# EAGLE design uc4h node v2010 (EAGLE 7.5.0)
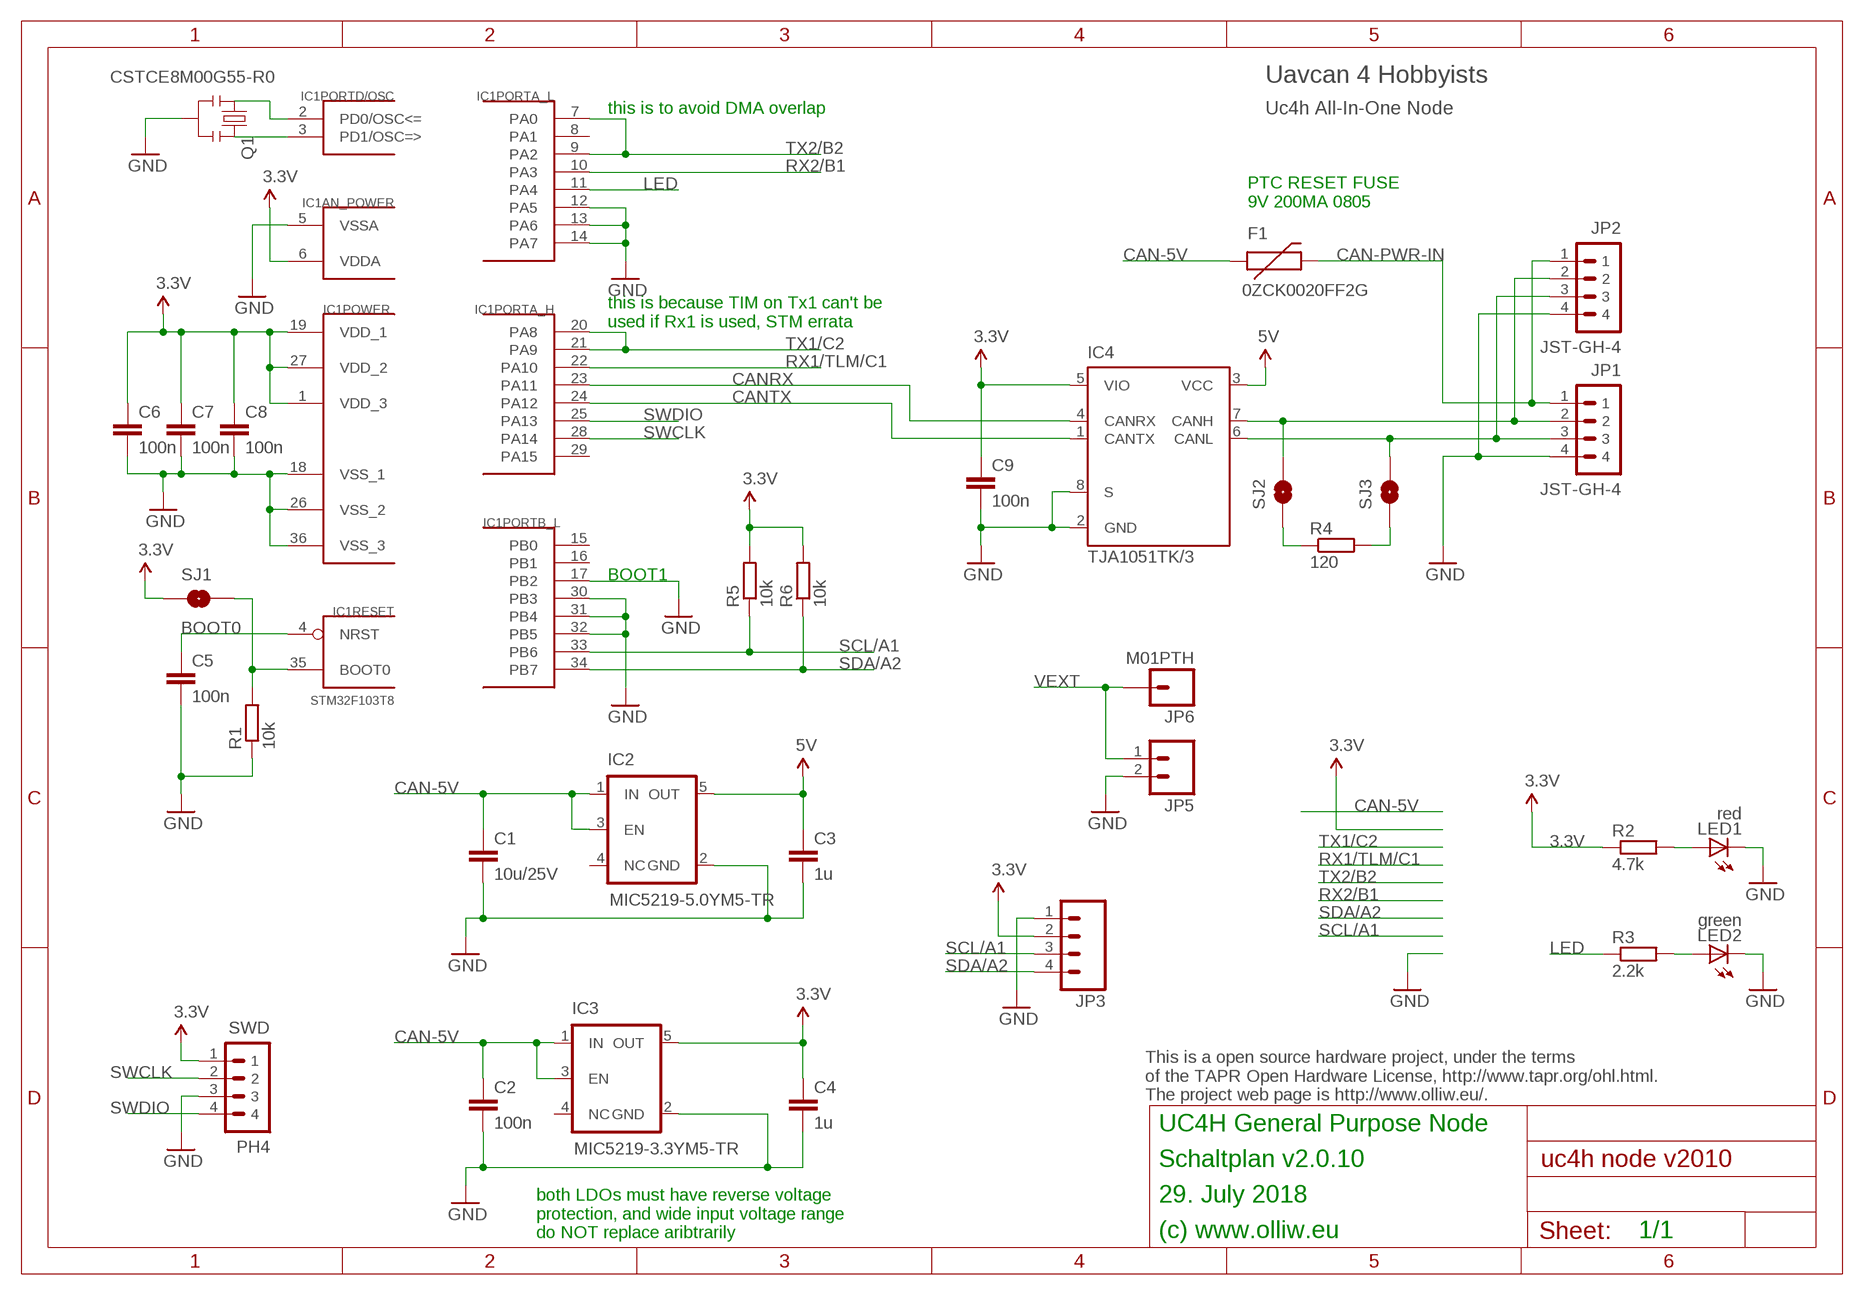
[diagram p0: schematic, sheet 1]

## Parts
C1  10u/25V  C-EUC1206  [C1206]
C2  100n  C-EUC0603K  [C0603K]
C3  1u  C-EUC0603K  [C0603K]
C4  1u  C-EUC0603K  [C0603K]
C5  100n  C-EUC0603K  [C0603K]
C6  100n  C-EUC0603K  [C0603K]
C7  100n  C-EUC0603K  [C0603K]
C8  100n  C-EUC0603K  [C0603K]
C9  100n  C-EUC0603K  [C0603K]
F1  0ZCK0020FF2G  FUSE-PTCFUSE-0805  [FUSE-0805]
IC1  STM32F103T8  STM32F10XTXU6  [VFQFPN36]
IC2  MIC5219-5.0YM5-TR  V_REG_TPS76433SOT23-5  [SOT23-5]
IC3  MIC5219-3.3YM5-TR  V_REG_TPS76433SOT23-5  [SOT23-5]
IC4  TJA1051TK/3  [HVSON8]
JP1  JST-GH-4  [SM04B-GHS-TB]
JP2  JST-GH-4  [SM04B-GHS-TB]
JP3  M04PTH  [1X04]
JP5  M02PTH  [1X02]
JP6  M01PTH  [1X01]
LED1  red  LEDCHIPLED_0603  [CHIPLED_0603]
LED2  green  LEDCHIPLED_0603  [CHIPLED_0603]
Q1  CSTCE8M00G55-R0  RESONATORSMD  [RESONATOR-SMD]
R1  10k  R-EU_R0603  [R0603]
R2  4.7k  R-EU_R0603  [R0603]
R3  2.2k  R-EU_R0603  [R0603]
R4  120  R-EU_R0603  [R0603]
R5  10k  R-EU_R0603  [R0603]
R6  10k  R-EU_R0603  [R0603]
SJ1  BOOT0  SOLDERJUMPERNO  [SJ_2S-NO]
SJ2  SOLDERJUMPERNO  [SJ_2S-NO]
SJ3  SOLDERJUMPERNO  [SJ_2S-NO]
SWD  PH4  P4X1_1P27-OCT_BILEX  [4X1_1P27_OCT_BILEX]

## Nets
3.3V: C4.1 C6.1 C7.1 C8.1 C9.1 IC1.1(POWER:VDD_3) IC1.6(AN_POWER:VDDA) IC1.19(POWER:VDD_1) IC1.27(POWER:VDD_2) IC3.5(OUT) IC4.5(VIO) JP3.2 R2.1 R5.2 R6.2 SJ1.1 SWD.1
5V: C3.1 IC2.5(OUT) IC4.3(VCC)
CAN-5V: C1.1 C2.1 F1.1 IC2.1(IN) IC2.3(EN) IC3.1(IN) IC3.3(EN)
CAN-PWR-IN: F1.2 JP1.1 JP2.1
CANH: IC4.7(CANH) JP1.2 JP2.2 SJ2.2
CANL: IC4.6(CANL) JP1.3 JP2.3 SJ3.2
CANRX: IC1.23(PORTA_H:PA11) IC4.4(CANRX)
CANTX: IC1.24(PORTA_H:PA12) IC4.1(CANTX)
GND: C1.2 C2.2 C3.2 C4.2 C5.2 C6.2 C7.2 C8.2 C9.2 IC1.5(AN_POWER:VSSA) IC1.12(PORTA_L:PA5) IC1.13(PORTA_L:PA6) IC1.14(PORTA_L:PA7) IC1.17(PORTB_L:PB2) IC1.18(POWER:VSS_1) IC1.26(POWER:VSS_2) IC1.30(PORTB_L:PB3) IC1.31(PORTB_L:PB4) IC1.32(PORTB_L:PB5) IC1.36(POWER:VSS_3) IC2.2(GND) IC3.2(GND) IC4.2(GND) IC4.8(S) JP1.4 JP2.4 JP3.1 JP5.2 LED1.C LED2.C Q1.2 R1.1 SWD.3
LED: IC1.11(PORTA_L:PA4) R3.1
N$1: C5.1 IC1.4(RESET:NRST)
N$2: LED2.A R3.2
N$4: R4.1 SJ2.1
N$5: IC1.2(PORTD/OSC:PD0/OSC<=) Q1.1
N$6: IC1.3(PORTD/OSC:PD1/OSC=>) Q1.3
N$7: R4.2 SJ3.1
N$8: IC1.35(RESET:BOOT0) R1.2 SJ1.2
N$9: LED1.A R2.2
RX1/TLM/C1: IC1.22(PORTA_H:PA10)
RX2/B1: IC1.10(PORTA_L:PA3)
SCL/A1: IC1.33(PORTB_L:PB6) JP3.3 R5.1
SDA/A2: IC1.34(PORTB_L:PB7) JP3.4 R6.1
SWCLK: IC1.28(PORTA_H:PA14) SWD.2
SWDIO: IC1.25(PORTA_H:PA13) SWD.4
TX1/C2: IC1.20(PORTA_H:PA8) IC1.21(PORTA_H:PA9)
TX2/B2: IC1.7(PORTA_L:PA0) IC1.9(PORTA_L:PA2)
VEXT: JP5.1 JP6.1
Unconnected: IC1.8(PORTA_L:PA1) IC1.15(PORTB_L:PB0) IC1.16(PORTB_L:PB1) IC1.29(PORTA_H:PA15) IC2.4(NC) IC3.4(NC)

## Notes on the sheet
- Uavcan 4 Hobbyists
- Uc4h All-In-One Node
- this is to avoid DMA overlap
- PTC RESET FUSE
  9V 200MA 0805
- this is because TIM on Tx1 can't be
  used if Rx1 is used, STM errata
- BOOT1
- This is a open source hardware project, under the terms
  of the TAPR Open Hardware License, http://www.tapr.org/ohl.html.
  The project web page is http://www.olliw.eu/.
- UC4H General Purpose Node
- Schaltplan v2.0.10
- 29. July 2018
- both LDOs must have reverse voltage
  protection, and wide input voltage range
  do NOT replace aribtrarily
- (c) www.olliw.eu | 1/1

## Library data of the parts
C1-C9 = rcl:C-EU: CAPACITOR, European symbol
F1 = # stdlib:FUSE-PTC
IC1 = # stm32:STM32F10XTXU6: STM32F101/103 36pad VFQPFN36
IC2 IC3 = # SparkFun2:V_REG_TPS76433: Voltage Regulator Older TI part. LDO 150mA regulator. No output by-pass cap option. See V_REG_LDO for a better part.
IC4 = # stdlib:TJA1051TK/3
JP1 JP2 = # stdlib:JST-GH-4
JP3 = # SparkFun2:M04: Header 4 Standard 4-pin 0.1" header. Use with straight break away headers (SKU : PRT-00116), right angle break away headers (PRT-00553), swiss pins (PRT-00743), machine pins (PRT-00117), and female headers (PRT-00115). Molex polarized connector foot print use with SKU : PRT-08231 with associated crimp pins and housings. 1MM SMD Version SKU: PRT-10208
JP5 = # SparkFun2:M02: Header 2 Standard 2-pin 0.1" header. Use with straight break away headers (SKU : PRT-00116), right angle break away headers (PRT-00553), swiss pins (PRT-00743), machine pins (PRT-00117), and female headers (PRT-00115). Molex polarized connector foot print use with SKU : PRT-08233 with associated crimp pins and housings.
JP6 = # SparkFun2:M01: Header 1 Standard 1-pin 0.1" header. Use with straight break away headers (SKU : PRT-00116), right angle break away headers (PRT-00553), swiss pins (PRT-00743), machine pins (PRT-00117), and female headers (PRT-00115).
LED1 LED2 = led:LED: LED OSRAM: - CHIPLED LG R971, LG N971, LY N971, LG Q971, LY Q971, LO R971, LY R971 LH N974, LH R974 LS Q976, LO Q976, LY Q976 LO Q996 - Hyper CHIPLED LW Q18S LB Q993, LB Q99A, LB R99A - SideLED LS A670, LO A670, LY A670, LG A670, LP A670 LB A673, LV A673, LT A673, LW A673 LH A674 LY A675 LS A676, LA A676, LO A676, LY A676, LW A676 LS A679, LY A679, LG A679 - Hyper Micro SIDELED® LS Y876, LA Y876, LO Y876, LY Y876 LT Y87S - SmartLED LW L88C, LW L88S LB L89C, LB L89S, LG L890 LS L89K, LO L89K, LY L89K LS L896, LA L896, LO L896, LY L896 - TOPLED LS T670, LO T670, LY T670, LG T670, LP T670 LSG T670, LSP T670, LSY T670, LOP T670, LYG T670 LG T671, LOG T671, LSG T671 LB T673, LV T673, LT T673, LW T673 LH T674 LS T676, LA T676, LO T676, LY T676, LB T676, LH T676, LSB T676, LW T676 LB T67C, LV T67C, LT T67C, LS T67K, LO T67K, LY T67K, LW E67C LS E67B, LA E67B, LO E67B, LY E67B, LB E67C, LV E67C, LT E67C LW T67C LS T679, LY T679, LG T679 LS T770, LO T770, LY T770, LG T770, LP T770 LB T773, LV T773, LT T773, LW T773 LH T774 LS E675, LA E675, LY E675, LS T675 LS T776, LA T776, LO T776, LY T776, LB T776 LHGB T686 LT T68C, LB T68C - Hyper Mini TOPLED® LB M676 - Mini TOPLED Santana® LG M470 LS M47K, LO M47K, LY M47K Source: http://www.osram.convergy.de LUXEON: - LUMILED® LXK2-PW12-R00, LXK2-PW12-S00, LXK2-PW14-U00, LXK2-PW14-V00 LXK2-PM12-R00, LXK2-PM12-S00, LXK2-PM14-U00 LXK2-PE12-Q00, LXK2-PE12-R00, LXK2-PE12-S00, LXK2-PE14-T00, LXK2-PE14-U00 LXK2-PB12-K00, LXK2-PB12-L00, LXK2-PB12-M00, LXK2-PB14-N00, LXK2-PB14-P00, LXK2-PB14-Q00 LXK2-PR12-L00, LXK2-PR12-M00, LXK2-PR14-Q00, LXK2-PR14-R00 LXK2-PD12-Q00, LXK2-PD12-R00, LXK2-PD12-S00 LXK2-PH12-R00, LXK2-PH12-S00 LXK2-PL12-P00, LXK2-PL12-Q00, LXK2-PL12-R00 Source: www.luxeon.com KINGBRIGHT: KA-3528ASYC Source: www.kingbright.com
Q1 = # SparkFun2:RESONATOR: Resonator Small SMD resonator. This is the itty bitty 10/20MHz resonators with built in caps. CSTCE10M0G55 and CSTCE20M0V53. Footprint has been reviewed closely but hasn't been tested yet.
R1-R6 = rcl:R-EU_: RESISTOR, European symbol
SJ1-SJ3 = # SparkFun2:SOLDERJUMPER: Solder Jumper Standard SMD solder jumper. Used to automate production. Two varients : Normally Open and Normally Closed are the same, but have different paste layers. NC will have a large amount of paste and should jumper during reflow.
SWD = # stdlib:P4X1_1P27

## Board
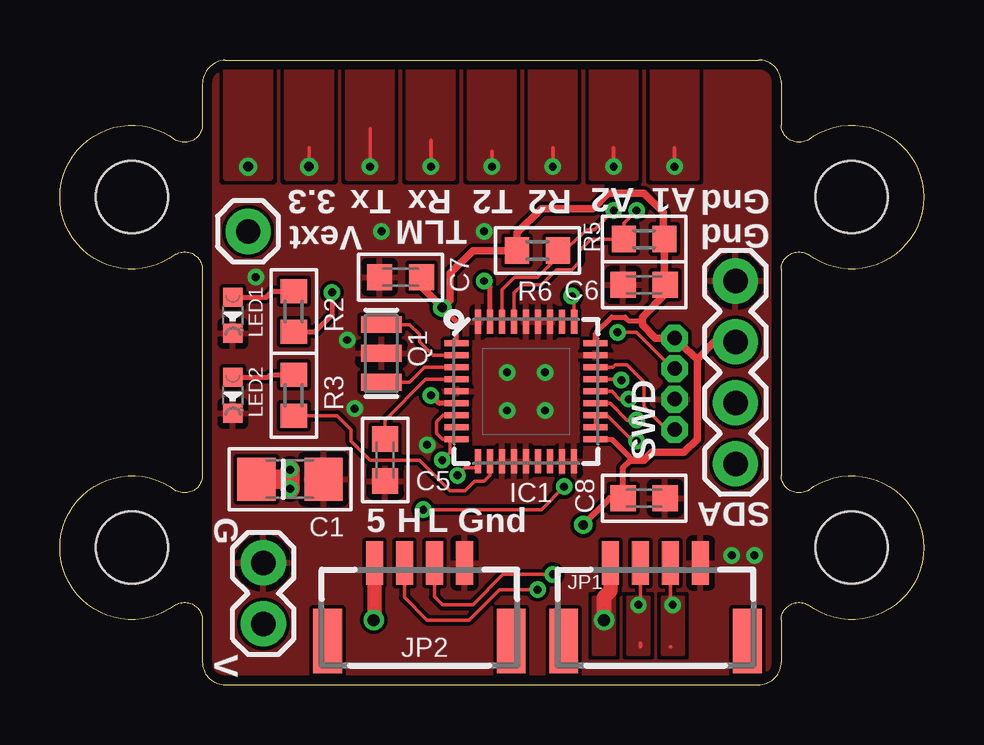
[diagram p1: board, top side]
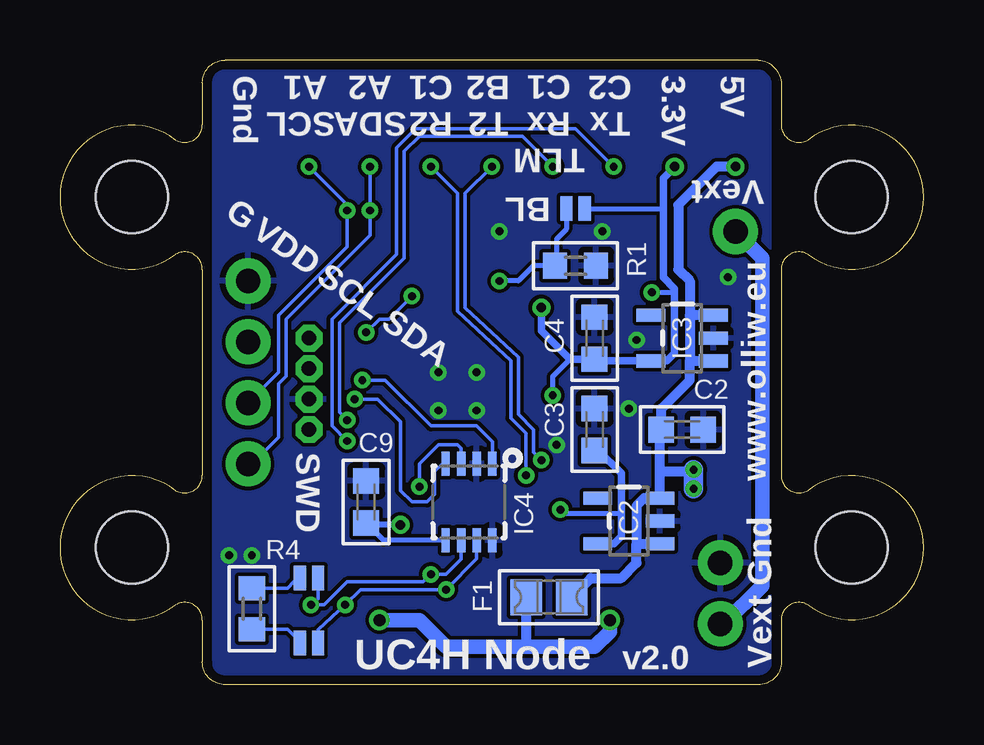
[diagram p2: board, bottom side, seen from below]

Size 36 x 26.04 mm. Coordinates in mm from the lower left corner, seen from the top.
Outline: 6.89,0 29.11,0 arc90 30.07,0.95 30.07,2.7 arc-120 31.18,3.33 arc255 31.18,8.1 arc-120 30.07,8.73 30.07,17.3 arc-120 31.18,17.94 arc255 31.18,22.7 arc-120 30.07,23.34 30.07,25.08 arc90 29.11,26.04 6.89,26.04 arc90 5.94,24.92 5.94,23.34 arc-120 4.83,22.7 arc255 4.83,17.94 arc-120 5.94,17.3 5.94,8.73 arc-120 4.83,8.1 arc255 4.83,3.33 arc-120 5.94,2.7 5.94,0.95 arc90 6.89,0
Copper layers (1*16): Top 0.0356mm / dielectric 1.5011mm / Bottom 0.0356mm
Design rules "ow-oshpark-2layer": minimum track width 6mil, minimum drill 13mil, track to track 6mil, track to pad 6mil, pad to pad 6mil, via to via 6mil, smd to smd 6mil, copper to edge 15mil, drill to drill 6mil, minimum pad ring 7mil, minimum via ring 7mil, stop-mask expansion 2.5mil, vias tented up to drill 26mil, thermal gap 10mil
Holes 3 mm at 3,20.32 33,20.32 3,5.71 33,5.71

### Footprints (pad centres in the part's own frame; a part is rotated, then mirrored left to right if it is on the bottom)
C1206 = smd 1.6 x 1.8: 1 -1.4,0; 2 1.4,0
C0603K = smd 1.05 x 1.08: 1 -0.875,0; 2 0.875,0
FUSE-0805 = smd 1.3 x 1.5: 1 -0.95,0; 2 0.95,0
VFQFPN36 = smd 1 x 0.25: 1 -2.9,2; 2 -2.9,1.5; 3 -2.9,1; 4 -2.9,0.5; 5 -2.9,0; 6 -2.9,-0.5; 7 -2.9,-1; 8 -2.9,-1.5; 9 -2.9,-2; 19 2.9,-2; 20 2.9,-1.5; 21 2.9,-1; 22 2.9,-0.5; 23 2.9,0; 24 2.9,0.5; 25 2.9,1; 26 2.9,1.5; 27 2.9,2 | smd 0.25 x 1: 10 -2,-2.9; 11 -1.5,-2.9; 12 -1,-2.9; 13 -0.5,-2.9; 14 0,-2.9; 15 0.5,-2.9; 16 1,-2.9; 17 1.5,-2.9; 18 2,-2.9; 29 1.5,2.9; 30 1,2.9; 31 0.5,2.9; 32 0,2.9; 33 -0.5,2.9; 34 -1,2.9; 35 -1.5,2.9; 36 -2,2.9 | smd 0.27 x 1: 28 2,2.9
SOT23-5 = smd 0.55 x 1.2: 1 -0.95,-1.3; 2 0,-1.3; 3 0.95,-1.3; 4 0.95,1.3; 5 -0.95,1.3
HVSON8 = smd 1 x 0.35: 1 -1.6,0.975; 2 -1.6,0.325; 3 -1.6,-0.325; 4 -1.6,-0.975; 5 1.6,-0.975; 6 1.6,-0.325; 7 1.6,0.325; 8 1.6,0.975
SM04B-GHS-TB = smd 0.7 x 1.8: 1 -1.875,4.6; 2 -0.625,4.6; 3 0.625,4.6; 4 1.875,4.6 | smd 1.2 x 2.7: FIT@1 -3.825,1.35; FIT@2 3.825,1.35
1X04 = drill 1.016 pad 1.88: 1 0,0; 2 2.54,0; 3 5.08,0; 4 7.62,0
1X02 = drill 1.016 pad 1.88: 1 0,0; 2 2.54,0
1X01 = drill 1.016 pad 1.88: 1 0,0
CHIPLED_0603 = smd 0.8 x 0.8: A 0,-0.75; C 0,0.75
RESONATOR-SMD = smd 0.7 x 1.7: 1 -1.2,0; 2 0,0; 3 1.2,0
R0603 = smd 1 x 1.1: 1 -0.85,0; 2 0.85,0
SJ_2S-NO = smd 0.508 x 1.016: 1 -0.381,0; 2 0.381,0
4X1_1P27_OCT_BILEX = drill 0.61 pad 1.118 octagon: 1 0,0; 2 0,-1.27; 3 0,-2.54; 4 0,-3.81

### Placement (x,y rotation side)
C1  9.59,8.57 0 top
C2  10.06,10.64 0 bottom
C3  13.72,10.64 90 bottom
C4  13.72,14.45 90 bottom
C5  13.56,9.37 270 top
C6  24.35,16.67 180 top
C7  14.19,16.99 180 top
C8  24.35,7.78 0 top
C9  23.24,7.62 90 bottom
F1  15.62,3.65 180 bottom
IC1  19.43,12.22 0 top
IC2  12.29,6.83 90 bottom
IC3  10.06,14.45 90 bottom
IC4  18.95,7.62 270 bottom
JP1  24.83,0.48 0 top
JP2  14.99,0.48 0 top
JP3  28.16,16.83 270 top
JP5  8.48,2.54 90 top
JP6  7.84,18.89 0 top
LED1  7.21,15.4 180 top
LED2  7.21,12.06 180 top
Q1  13.4,13.81 270 top
R1  14.51,17.46 180 bottom
R2  9.75,15.56 90 top
R3  9.75,12.06 90 top
R4  28,3.17 90 bottom
R5  24.35,18.57 0 top
R6  19.91,18.1 180 top
SJ1  14.51,19.84 180 bottom
SJ2  25.62,1.75 0 bottom
SJ3  25.62,4.45 0 bottom
SWD  25.62,14.45 0 top

### Tracks (layer width: path | path; a pad name or v marks a point on that pad's centre or on a via)
3.3V  (via drill 0.33, 0.4)
  Top 0.152: 25.15,18.79 R5.2 | 25.2,17.01 C6.1 | C7.1 15.07,16.59 | v10.38,21.59 10.38,22.38
  Top 0.203: IC1.6 15.8,11.72 v15.46,12.06 | v11.34,16.35 11.34,15.4 10.64,14.71 R2.1 | IC1.27 22.33,14.65 23,15.32 23.56,15.32 23.72,15.16 24.27,15.16 | IC1.1 16.53,15.12 v15.94,15.72 | IC1.19 23.02,10.22 23.88,9.37
  Top 0.254: 23.8,9.37 23.48,9.05 C8.1 22.92,7.78 v21.81,6.67
  Top 0.305: 23.8,9.37 23.88,9.37 24.35,9.37 24.67,9.68 26.02,9.68 26.58,10.24 26.58,13.57 | 26.58,13.57 SWD.1 24.83,14.45 24.27,15 24.27,15.16 24.27,15.32 25.23,16.27 C6.1 | 25.15,18.79 25.15,19.68 24.35,20.48 22.84,20.48 22.21,19.84 20.07,19.84 19.06,18.84 R6.2 17.21,18.1 16.26,17.14 16.26,16.03 v15.94,15.72 15.07,16.59 | R5.2 25.2,17.01 | JP3.2 27.29,14.29 26.58,13.57
  Bottom 0.152: 11.68,13.49 IC3.5
  Bottom 0.203: IC4.5 22.52,6.02 C9.1 | 13.8,13.5 C4.1 | v15.46,12.06 15.46,12.86 14.75,13.57 | SJ1.1 10.86,19.84 | v11.34,16.35 10.38,16.35 10.38,16.11
  Bottom 0.254: v21.81,6.67 22.92,6.67 23,6.75 C9.1
  Bottom 0.305: IC3.5 13.8,13.5 | C4.1 14.75,13.57 15.94,14.76 v15.94,15.72 | v10.38,21.59 10.86,21.11 10.86,19.84 10.86,16.99 10.38,16.51 10.38,16.11 10.38,13.81 10.7,13.49 11.68,13.49
  pour Top (isolate 0.254, no thermals): 9.43,25.72 9.43,21.11 11.33,21.11 11.33,25.72
5V  (via drill 0.33)
  Top 0.152: v21.02,8.26 20.07,7.3 v15.15,7.3
  Bottom 0.152: IC4.3 19.28,9.85 19.43,10 20.22,10 21.02,9.21 v21.02,8.26 | C3.1 13.55,9.76
  Bottom 0.203: 13.56,6.07 IC2.5 | v15.15,7.3 14.99,7.14 12.6,7.14
  Bottom 0.305: IC2.5 12.92,5.88 12.6,6.19 12.6,7.14 12.6,8.81 13.55,9.76
CAN-5V  (via drill 0.33, 0.4)
  Top 0.152: 8.32,8.28 C1.1
  Top 0.203: 9.43,8.57 v9.59,8.97
  Top 0.813: C1.1 9.43,8.57 | v9.59,8.97 v9.59,8.18
  Bottom 0.152: 9.51,8.89 v9.59,8.97 | 9.11,15.27 IC3.3 | 9.75,15.4 9.75,15.24
  Bottom 0.203: IC2.1 | F1.1 | 10.99,10.27 C2.1 | 9.08,13.49 IC3.1
  Bottom 0.406: 11.97,5.87 11.97,7.46 11.66,7.78 IC2.3 10.99,8.89 | 11.97,5.87 IC2.1 | F1.1 13.87,4.45 12.6,4.45 11.97,5.08 11.97,5.87 | 10.99,8.89 10.99,10.27 | IC3.3 9.75,15.4 | 9.75,13.49 9.08,13.49 | C2.1 10.94,11.51 9.75,12.7 9.75,13.49 | 10.99,8.89 9.51,8.89 | 9.75,13.49 9.75,15.24 9.75,16.83 10.22,17.3 10.22,20 8.64,21.59 v7.84,21.59
  Bottom 0.813: v9.59,8.18 v9.59,8.97
  pour Top (isolate 0.254, no thermals): 6.89,25.72 6.89,21.11 8.79,21.11 8.79,25.72
CAN-PWR-IN  (via drill 0.5)
  Top 0.152: v13.08,2.7 13.11,2.67
  Top 0.61: 13.11,2.67 JP2.1 | JP1.1 22.95,3.92 22.69,3.65 v22.69,2.7
  Bottom 0.406: F1.2 16.57,1.59 16.42,1.59
  Bottom 0.61: v22.69,2.7 21.02,2.7 19.91,1.59 16.42,1.59 13.72,1.59 13.08,2.22 v13.08,2.7
  pour Top (no thermals): 23.12,3.65 22.25,3.65 22.25,1.27 23.12,1.27
CANH  (via drill 0.33)
  Top 0.152: JP2.2 14.36,3.64 15.3,2.7 17.05,2.7 18.32,3.97 v19.91,3.97 | JP1.2 24.2,3.42 v24.11,3.33 | 24.2,1.74 24.19,1.59
  Bottom 0.152: SJ2.2 25.24,2.29 v24.11,3.33 23.48,3.97 v19.91,3.97 18.63,5.25 IC4.7
  pour Top (no thermals): 23.68,3.65 24.55,3.65 24.55,1.27 23.68,1.27
CANL  (via drill 0.33)
  Top 0.152: JP2.3 15.61,3.66 15.94,3.33 17.21,3.33 18.48,4.6 v20.54,4.6 | JP1.3 25.45,3.4 v25.54,3.33 | 25.45,1.58 25.46,1.59
  Bottom 0.152: SJ3.2 25.24,3.59 v25.54,3.33 24.99,3.33 24.04,4.29 20.86,4.29 v20.54,4.6 19.91,4.6 19.28,5.23 IC4.6
  pour Top (no thermals): 25.11,3.65 25.98,3.65 25.98,1.27 25.11,1.27
CANRX  (via drill 0.33)
  Top 0.152: IC1.23 23,12.22 23.32,11.91 v23.72,11.91
  Bottom 0.152: v23.72,11.91 22.77,11.91 21.81,10.95 21.81,8.1 21.34,7.62 20.7,7.62 20.38,7.94 20.38,8.89 20.05,9.22 IC4.4
CANTX  (via drill 0.33)
  Top 0.152: IC1.24 23.38,12.72 v23.4,12.7
  Bottom 0.152: IC4.1 17.98,10.14 18.64,10.79 20.54,10.79 22.45,12.7 v23.4,12.7
GND  (via drill 0.33)
  other vias: 18.64,13.02 18.64,11.43 20.22,11.43 20.22,13.02 28.96,5.4 15.3,10 12.29,11.51 28,5.4 17.68,18.89 8.16,16.99 13.4,18.89 11.97,14.37
  pour Bottom (isolate 0.152, rank 6): 6.41,25.72 29.59,25.72 29.59,0.16 6.41,0.16
  pour Top (isolate 0.152, rank 6): 6.41,25.72 29.59,25.72 29.59,0.16 6.41,0.16
LED
  Top 0.152: IC1.11 17.93,8.74 17.68,8.49 17.29,8.49 16.89,8.1 16.26,8.1 14.99,9.37 12.92,9.37 12.13,10.16 12.13,10.64 11.55,11.21 R3.1
N$1
  Top 0.152: IC1.4 15.25,12.72 13.56,11.03 C5.1
N$2
  Top 0.203: LED2.A 8.67,12.81 8.77,12.91 R3.2
N$4
  Bottom 0.152: R4.1 26.52,2.33 26.26,2.06 26,2.06 SJ2.1
N$5
  Top 0.152: IC1.2 15.55,13.72 14.99,14.29 14.99,14.61 14.58,15.01 Q1.1
N$6
  Top 0.152: IC1.3 15.19,13.22 14.58,12.61 Q1.3
N$7
  Bottom 0.152: R4.2 26.52,4.03 26.26,4.29 26.16,4.29 SJ3.1
N$8  (via drill 0.33)
  Top 0.203: IC1.35 17.93,16.58 v17.68,16.83
  Bottom 0.152: 15.3,17.36 R1.2
  Bottom 0.203: v17.68,16.83 16.89,16.83 16.26,17.46 R1.2 | SJ1.2 14.89,18.99 15.3,18.57 15.3,17.36
N$9
  Top 0.203: LED1.A 8.59,16.15 8.85,16.41 R2.2
RX1/TLM/C1  (via drill 0.33)
  Top 0.152: IC1.22 22.95,11.72 23.64,11.03 v24.04,11.03 | v15.46,21.59 15.46,22.7
  Bottom 0.152: v24.04,11.03 24.35,11.35 24.35,15.08 21.65,17.78 21.65,22.23 21.02,22.86 16.73,22.86 v15.46,21.59
  pour Top (isolate 0.254, no thermals): 14.51,25.72 14.51,21.11 16.41,21.11 16.41,25.72
RX2/B1  (via drill 0.33)
  Top 0.152: v20.54,21.59 20.54,22.38 | IC1.10 17.45,9.32 17.45,9.05 16.89,9.05 v16.57,8.73
  Bottom 0.152: v16.57,8.73 16.57,10.48 17.21,11.11 17.21,13.49 19.43,15.56 19.43,20.48 v20.54,21.59
  pour Top (isolate 0.254, no thermals): 19.59,25.72 19.59,21.11 21.49,21.11 21.49,25.72
SCL/A1  (via drill 0.33)
  Top 0.152: IC1.33 18.93,16.33 19.27,16.67 20.07,16.67 20.7,17.3 21.34,17.3 21.65,17.62 21.65,18.1 22.13,18.57 R5.1 23.5,19.23 v24.04,19.76 | v25.62,21.59 25.62,22.38
  Bottom 0.152: JP3.3 26.89,13.02 26.89,15.4 24.04,18.26 v24.04,19.76 24.04,20 v25.62,21.59
  pour Top (isolate 0.254, no thermals): 24.67,25.72 24.67,21.11 26.57,21.11 26.57,25.72
SDA/A2  (via drill 0.33)
  Top 0.152: IC1.34 18.43,16.46 18.95,16.99 19.91,16.99 20.54,17.62 20.54,18.04 R6.1 21.02,18.1 21.97,18.97 22.29,18.97 v23.08,19.76 | v23.08,21.59 23.08,22.38
  Bottom 0.152: JP3.4 28,9.21 26.89,10.32 26.89,12.54 26.58,12.86 26.58,15.24 23.08,18.73 v23.08,19.76 v23.08,21.59
  pour Top (isolate 0.254, no thermals): 22.13,25.72 22.13,21.11 24.03,21.11 24.03,25.72
SWCLK  (via drill 0.33)
  Top 0.152: IC1.28 21.43,16.13 v21.34,16.19 | SWD.2 25.54,13.18 24.04,14.68 v23.24,14.68
  Bottom 0.152: v21.34,16.19 22.29,15.24 22.69,15.24 v23.24,14.68
SWDIO
  Top 0.152: IC1.25 23.05,13.22 23.16,13.34 23.64,13.34 24.35,12.62 24.35,11.59 25.31,10.64 SWD.4
TX1/C2  (via drill 0.33)
  Top 0.152: v24.04,10.16 23.88,10.16 22.81,11.22 IC1.21 IC1.20 | v12.92,21.59 12.92,23.18
  Bottom 0.152: v24.04,10.16 24.67,10.79 24.67,15.24 21.97,17.94 21.97,22.38 21.18,23.18 14.51,23.18 v12.92,21.59
  pour Top (isolate 0.254, no thermals): 11.97,25.72 11.97,21.11 13.87,21.11 13.87,25.72
TX2/B2  (via drill 0.33)
  Top 0.152: v18,21.59 18,22.23 | IC1.7 15.97,11.22 15.7,10.95 15.7,10.48 15.95,10.22 IC1.9 16.26,10.22 16.26,9.68 v15.94,9.37
  Bottom 0.152: v15.94,9.37 16.26,9.68 16.26,10.64 16.89,11.27 16.89,13.65 19.11,15.72 19.11,20.48 v18,21.59
  pour Top (isolate 0.254, no thermals): 17.05,25.72 17.05,21.11 18.95,21.11 18.95,25.72
VEXT
  Bottom 0.152: JP5.1 8.32,2.54
  Bottom 0.61: 8.32,2.54 6.73,4.13 6.73,17.78 JP6.1

### Text on the board
tNames: 3.3 | Tx | Rx | T2 | R2 | A2 | A1 | Gnd | Vext | TLM | Gnd | SWD | SDA | G | 5 | H | L | Gnd | V
bNames: 5V | 3.3V | Tx / C2 | TLM / Rx / C1 | T2 / B2 | R2 / C1 | SDA / A2 | SCL / A1 | Gnd | Vext | BL | G | VDD | SCL | SDA | SWD | www.olliw.eu | Gnd | Vext | v2.0 | UC4H Node